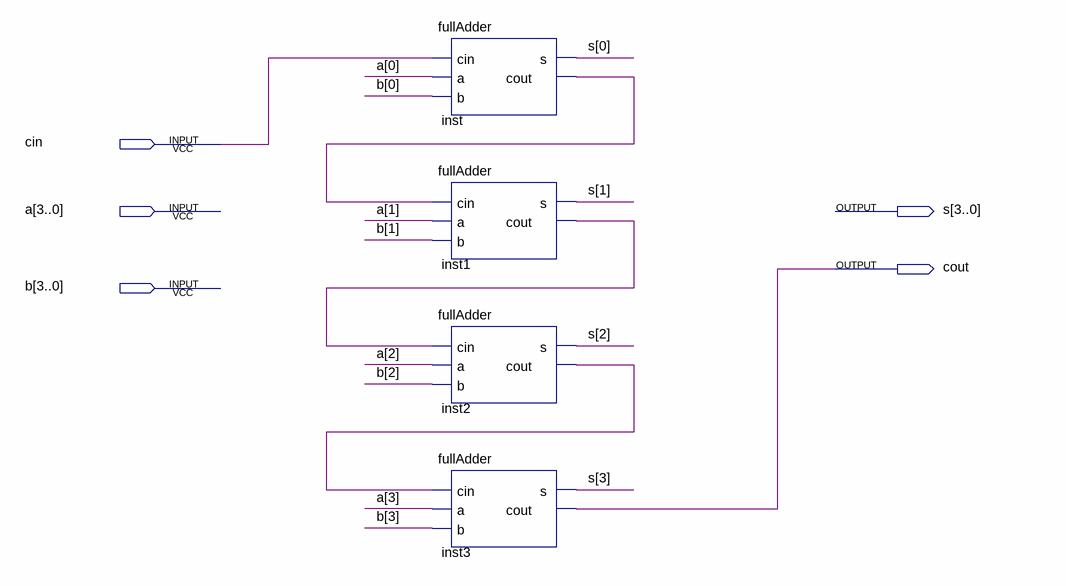
[diagram p0: schematic sheet]
// Quartus schematic adder4.bdf as structural Verilog: 4 symbols, 5 pins
module adder4 (
  input  cin,
  input  [3:0] a,
  input  [3:0] b,
  output [3:0] s,
  output cout
);

  wire inst1_cout, inst2_cout, inst_cout;

  fullAdder inst (.cin(cin), .a(a[0]), .b(b[0]), .s(s[0]), .cout(inst_cout));
  fullAdder inst1 (.cin(inst_cout), .a(a[1]), .b(b[1]), .s(s[1]), .cout(inst1_cout));
  fullAdder inst2 (.cin(inst1_cout), .a(a[2]), .b(b[2]), .s(s[2]), .cout(inst2_cout));
  fullAdder inst3 (.cin(inst2_cout), .a(a[3]), .b(b[3]), .s(s[3]), .cout(cout));
endmodule
